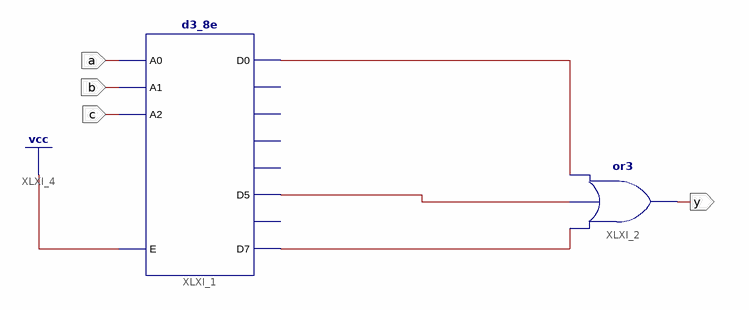
[diagram p0: schematic sheet 1]
// Xilinx ISE schematic ukol3.sch (spartan3) as structural Verilog: 2 symbols, 4 ports
module ukol3 (
  input  a,
  input  b,
  input  c,
  output y
);

  wire XLXN_4, XLXN_11, XLXN_12;

  d3_8e XLXI_1 (.A0(a), .A1(b), .A2(c), .E(1'b1), .D0(XLXN_4), .D5(XLXN_11), .D7(XLXN_12));  // open: D1, D2, D3, D4, D6
  or XLXI_2 (y, XLXN_12, XLXN_11, XLXN_4);
endmodule
